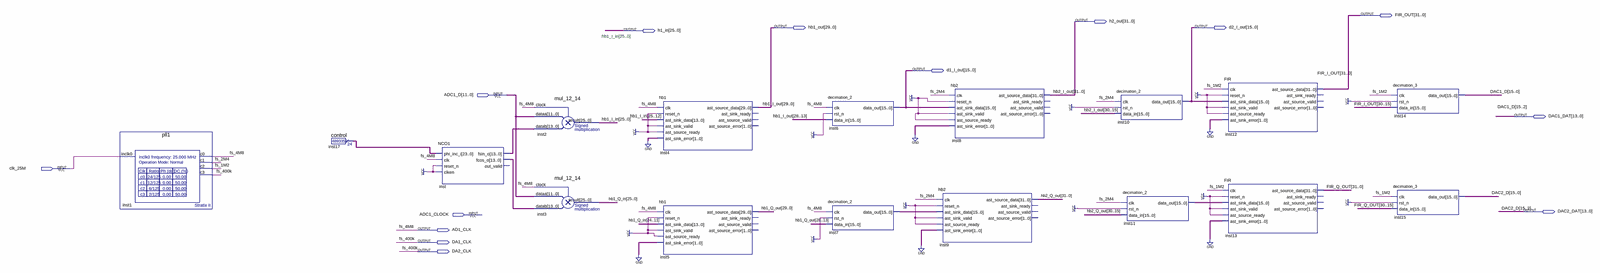
[diagram p0: schematic sheet, whole]
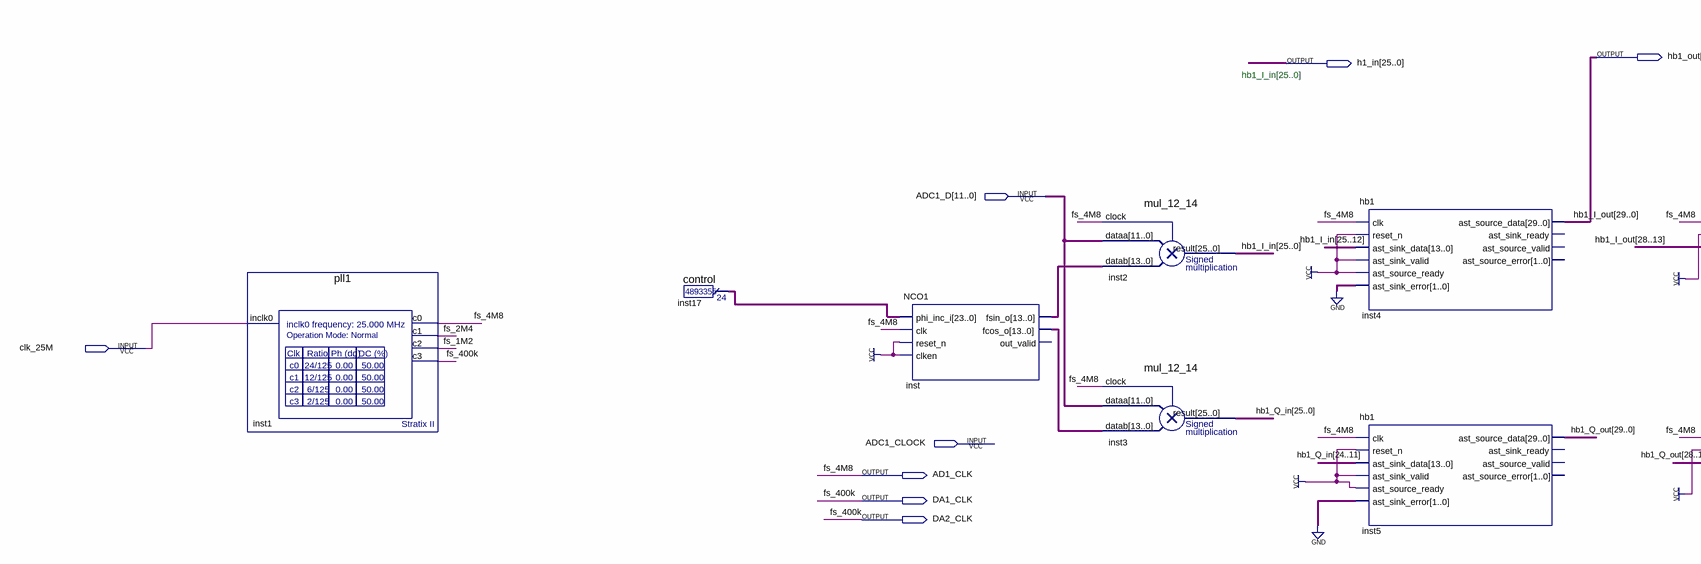
[diagram p1: schematic sheet, left part]
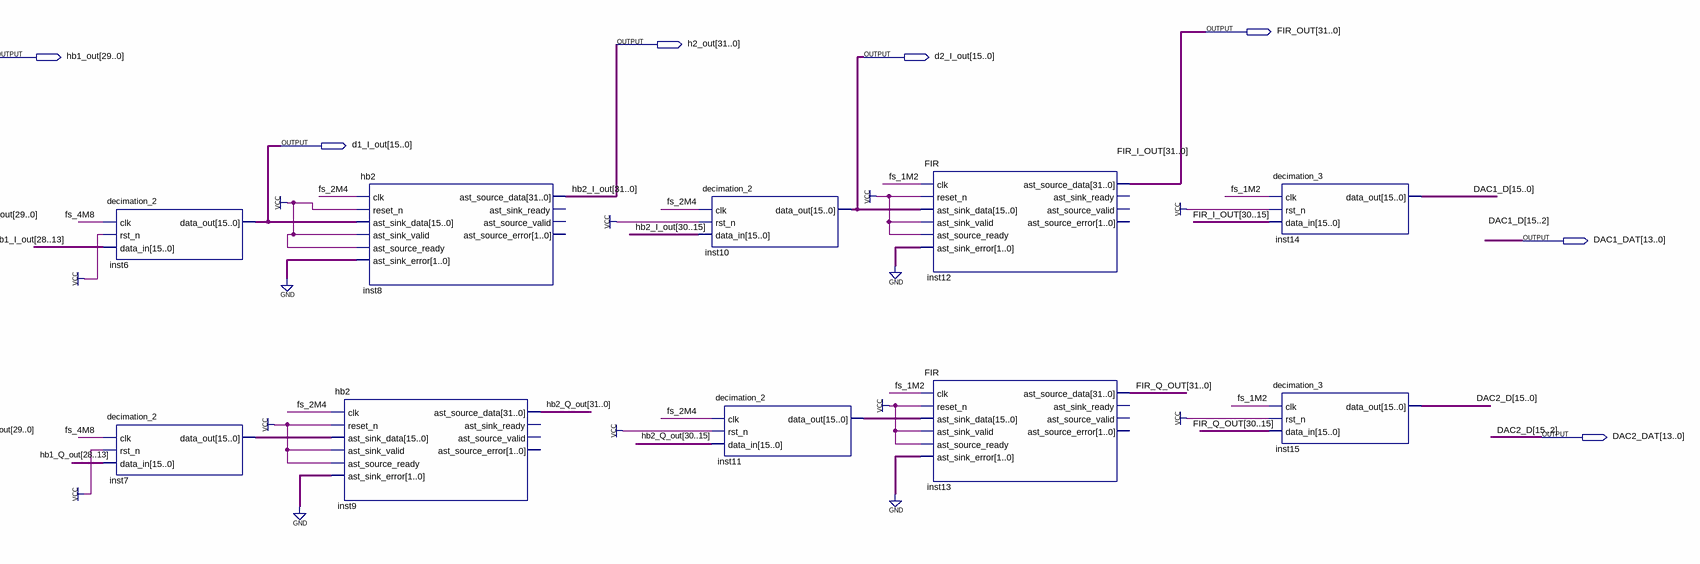
[diagram p2: schematic sheet, right part]
// Quartus schematic test.bdf as structural Verilog: 17 symbols, 14 pins
module test (
  input  [11:0] ADC1_D,
  input  clk_25M,
  input  ADC1_CLOCK,
  output [31:0] FIR_OUT,
  output [31:0] h2_out,
  output [29:0] hb1_out,
  output [15:0] d2_I_out,
  output [25:0] h1_in,
  output [15:0] d1_I_out,
  output [13:0] DAC1_DAT,
  output [13:0] DAC2_DAT,
  output AD1_CLK,
  output DA1_CLK,
  output DA2_CLK
);

  wire fs_1M2, fs_2M4;
  wire [1:0] DAC1_D, DAC2_D;
  wire [13:0] inst_fcos_o, inst_fsin_o;
  wire [15:0] inst7_data_out, inst11_data_out;
  wire [23:0] inst17_result;
  wire [25:0] hb1_I_in, hb1_Q_in;
  wire [29:0] hb1_Q_out;
  wire [31:0] FIR_Q_OUT, hb2_Q_out;

  pll1 inst1 (.inclk0(clk_25M), .c0(AD1_CLK), .c1(fs_2M4), .c2(fs_1M2), .c3(DA1_CLK));
  control inst17 (.result(inst17_result));
  NCO1 inst (
    .phi_inc_i(inst17_result), .clk(AD1_CLK), .reset_n(1'b1), .clken(1'b1), .fsin_o(inst_fsin_o),
    .fcos_o(inst_fcos_o));  // open: out_valid
  mul_12_14 inst2 (.dataa(ADC1_D), .datab(inst_fsin_o), .clock(AD1_CLK), .result(hb1_I_in));
  mul_12_14 inst3 (.dataa(ADC1_D), .datab(inst_fcos_o), .clock(AD1_CLK), .result(hb1_Q_in));
  hb1 inst4 (
    .clk(AD1_CLK), .reset_n(1'b1), .ast_sink_data(hb1_I_in[25:12]), .ast_sink_valid(1'b1),
    .ast_source_ready(1'b1), .ast_sink_error(2'b00), .ast_source_data(hb1_out));  // open: ast_sink_ready, ast_source_valid, ast_source_error
  hb1 inst5 (
    .clk(AD1_CLK), .reset_n(1'b1), .ast_sink_data(hb1_Q_in[24:11]), .ast_sink_valid(1'b1),
    .ast_source_ready(1'b1), .ast_sink_error(2'b00), .ast_source_data(hb1_Q_out));  // open: ast_sink_ready, ast_source_valid, ast_source_error
  decimation_2 inst6 (.clk(AD1_CLK), .rst_n(1'b1), .data_in(hb1_out[28:13]), .data_out(d1_I_out));
  decimation_2 inst7 (.clk(AD1_CLK), .rst_n(1'b1), .data_in(hb1_Q_out[28:13]), .data_out(inst7_data_out));
  hb2 inst8 (
    .clk(fs_2M4), .reset_n(1'b1), .ast_sink_data(d1_I_out), .ast_sink_valid(1'b1), .ast_source_ready(1'b1),
    .ast_sink_error(2'b00), .ast_source_data(h2_out));  // open: ast_sink_ready, ast_source_valid, ast_source_error
  hb2 inst9 (
    .clk(fs_2M4), .reset_n(1'b1), .ast_sink_data(inst7_data_out), .ast_sink_valid(1'b1),
    .ast_source_ready(1'b1), .ast_sink_error(2'b00), .ast_source_data(hb2_Q_out));  // open: ast_sink_ready, ast_source_valid, ast_source_error
  decimation_2 inst10 (.clk(fs_2M4), .rst_n(1'b1), .data_in(h2_out[30:15]), .data_out(d2_I_out));
  decimation_2 inst11 (.clk(fs_2M4), .rst_n(1'b1), .data_in(hb2_Q_out[30:15]), .data_out(inst11_data_out));
  FIR inst12 (
    .clk(fs_1M2), .reset_n(1'b1), .ast_sink_data(d2_I_out), .ast_sink_valid(1'b1), .ast_source_ready(1'b1),
    .ast_sink_error(2'b00), .ast_source_data(FIR_OUT));  // open: ast_sink_ready, ast_source_valid, ast_source_error
  FIR inst13 (
    .clk(fs_1M2), .reset_n(1'b1), .ast_sink_data(inst11_data_out), .ast_sink_valid(1'b1),
    .ast_source_ready(1'b1), .ast_sink_error(2'b00), .ast_source_data(FIR_Q_OUT));  // open: ast_sink_ready, ast_source_valid, ast_source_error
  decimation_3 inst14 (.clk(fs_1M2), .rst_n(1'b1), .data_in(FIR_OUT[30:15]), .data_out({DAC1_DAT, DAC1_D}));
  decimation_3 inst15 (.clk(fs_1M2), .rst_n(1'b1), .data_in(FIR_Q_OUT[30:15]), .data_out({DAC2_DAT, DAC2_D}));

  assign DA2_CLK = DA1_CLK;

  // Other names for the same wires on the sheet: DAC1_D[15:2] = DAC1_DAT; DAC2_D[15:2] = DAC2_DAT;
  //   FIR_I_OUT[31:0] = FIR_OUT; fs_4M8 = AD1_CLK; fs_400k = DA1_CLK; hb1_I_out[29:0] = hb1_out;
  //   hb2_I_out[31:0] = h2_out

  // Notes on the sheet:
  //   hb1_I_in[25..0]
endmodule
